# Altium schematic sheet Peripherals.SchDoc
size A; SheetNumber: 1; SheetTotal: 3
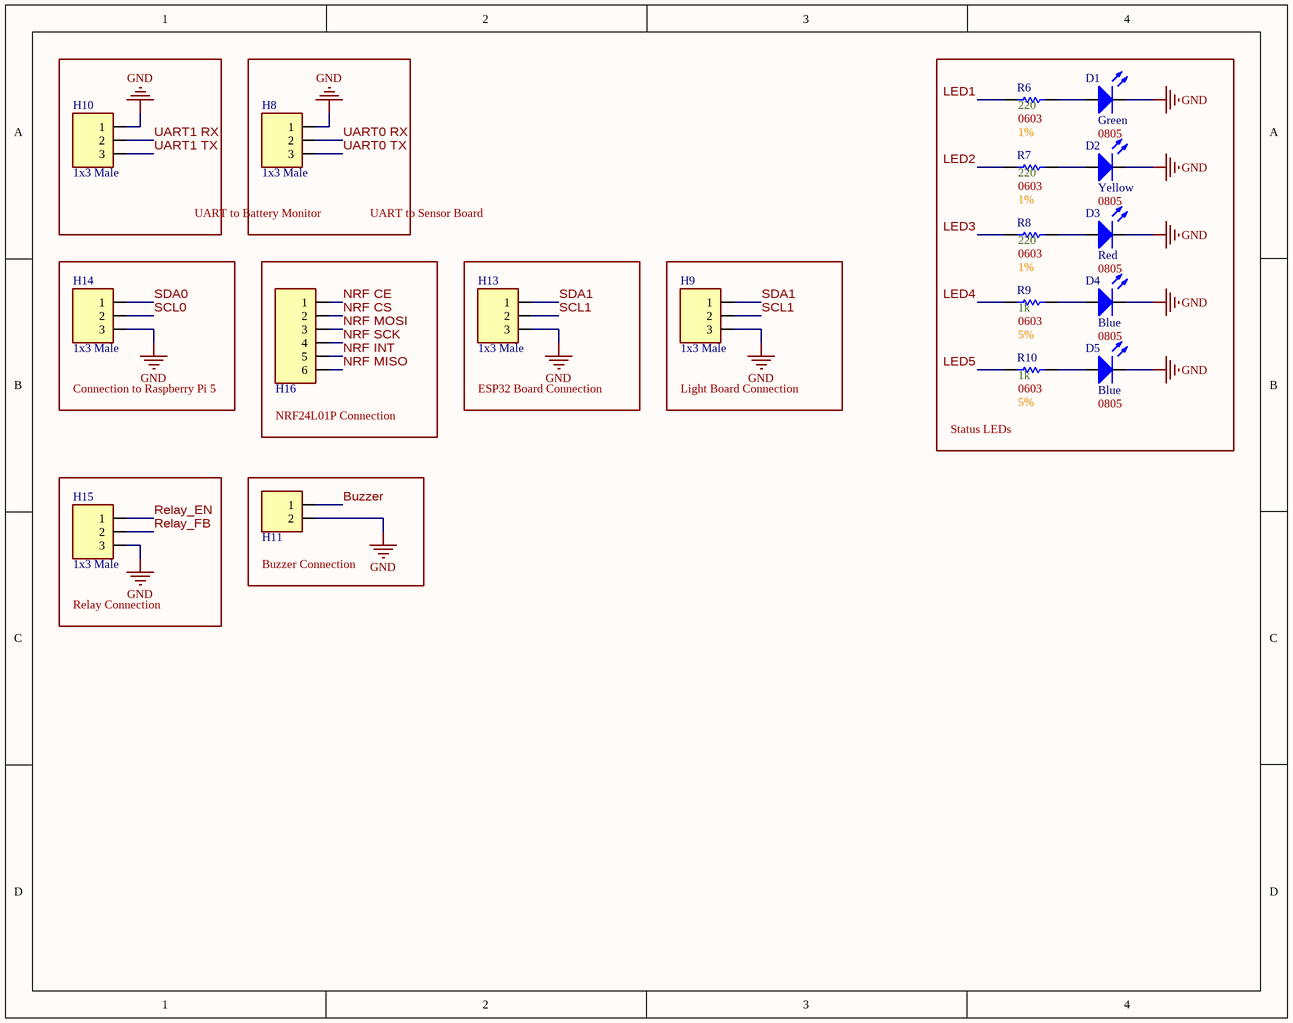
[diagram p0: Peripherals.SchDoc]

## Parts
D1  Color: Green  Size Package: 0805  [[LED] SMD 0805]  (hidden comment: SMD LED)
D2  Color: Yellow  Size Package: 0805  [[LED] SMD 0805]  (hidden comment: SMD LED)
D3  Color: Red  Size Package: 0805  [[LED] SMD 0805]  (hidden comment: SMD LED)
D4  Color: Blue  Size Package: 0805  [[LED] SMD 0805]  (hidden comment: SMD LED)
D5  Color: Blue  Size Package: 0805  [[LED] SMD 0805]  (hidden comment: SMD LED)
H8  1x3 Male  [[Header] Shrouded 1x3 Male]
H9  1x3 Male  [[Header] Shrouded 1x3 Male]
H10  1x3 Male  [[Header] Shrouded 1x3 Male]
H11  1x2 Male  [[Header] Shrouded 1x2 Male]  (value not drawn)
H13  1x3 Male  [[Header] Shrouded 1x3 Male]
H14  1x3 Male  [[Header] Shrouded 1x3 Male]
H15  1x3 Male  [[Header] Shrouded 1x3 Male]
H16  [Header] Shrouded 1x6 Male  [[Header] Shrouded 1x6 Male]  (value not drawn)
R6  Resistance: 220  Size Package: 0603  Tolerance: 1%  [[Res] SMD 0603]  (hidden comment: [Res] SMD Resistor)
R7  Resistance: 220  Size Package: 0603  Tolerance: 1%  [[Res] SMD 0603]  (hidden comment: [Res] SMD Resistor)
R8  Resistance: 220  Size Package: 0603  Tolerance: 1%  [[Res] SMD 0603]  (hidden comment: [Res] SMD Resistor)
R9  Resistance: 1k  Size Package: 0603  Tolerance: 5%  [[Res] SMD 0603]  (hidden comment: [Res] SMD Resistor)
R10  Resistance: 1k  Size Package: 0603  Tolerance: 5%  [[Res] SMD 0603]  (hidden comment: [Res] SMD Resistor)

## Blocks framed on the sheet
UART to Battery Monitor: H10
UART to Sensor Board: H8
Status LEDs: D1-D5 R6-R10
Connection to Raspberry Pi 5: H14
NRF24L01P Connection: H16
ESP32 Board Connection: H13
Light Board Connection: H9
Relay Connection: H15
Buzzer Connection: H11

## Nets
GND: D1.2(Cathode) D2.2(Cathode) D3.2(Cathode) D4.2(Cathode) D5.2(Cathode) H8.1 H9.3 H10.1 H11.2 H13.3 H14.3 H15.3
Buzzer: H11.1
LED1: R6.2
LED2: R7.2
LED3: R8.2
LED4: R9.2
LED5: R10.2
NRF CE: H16.1
NRF CS: H16.2
NRF INT: H16.5
NRF MISO: H16.6
NRF MOSI: H16.3
NRF SCK: H16.4
Relay_EN: H15.1
Relay_FB: H15.2
SCL0: H14.2
SCL1: H9.2 H13.2
SDA0: H14.1
SDA1: H9.1 H13.1
UART0 RX: H8.2
UART0 TX: H8.3
UART1 RX: H10.2
UART1 TX: H10.3
NetD1_1: D1.1(Anode) R6.1
NetD2_1: D2.1(Anode) R7.1
NetD3_1: D3.1(Anode) R8.1
NetD4_1: D4.1(Anode) R9.1
NetD5_1: D5.1(Anode) R10.1

## Library data of the parts
D1-D5 = [LED] SMD: Generic; Part #: *; Supplier 1: DigiKey
  D1: Supplier Part Number 1: 475-LGR971-KN-1CT-ND
  D2: Supplier Part Number 1: 475-LYR976-PS-36-0-20-R18CT-ND
  D3: Supplier Part Number 1: 475-LSR976-NR-1CT-ND
  D4 D5: Supplier Part Number 1: 732-4982-1-ND
H8-H10 H13-H15 = [Header] Shrouded 1x3 Male: 070543-0037 / Mates with 005057-9403; Supplier 1: DigiKey; Supplier Part Number 1: WM4825-ND
  H8 H9 H13-H15: Supplier 2: DigiKey; Supplier Part Number 2: WM2901-ND
H11 = [Header] Shrouded 1x2 Male: 0705430036 / Mates with 0050579402; Supplier 1: DigiKey; Supplier 2: DigiKey; Supplier Part Number 2: WM2900-ND; Supplier Part Number 1: WM4824-ND
H16 = [Header] Shrouded 1x6 Male: 0705430005 / Mates with 0050579406; Supplier 1: DigiKey; Supplier 2: DigiKey; Supplier Part Number 1: WM4804-ND; Supplier Part Number 2: WM2904-ND
R6-R10 = [Res] SMD Resistor: Generic; Supplier 1: DigiKey
  R6-R8: Supplier Part Number 1: 311-220HRCT-ND
  R9 R10: Supplier Part Number 1: RMCF0603FT1K00DKR-ND